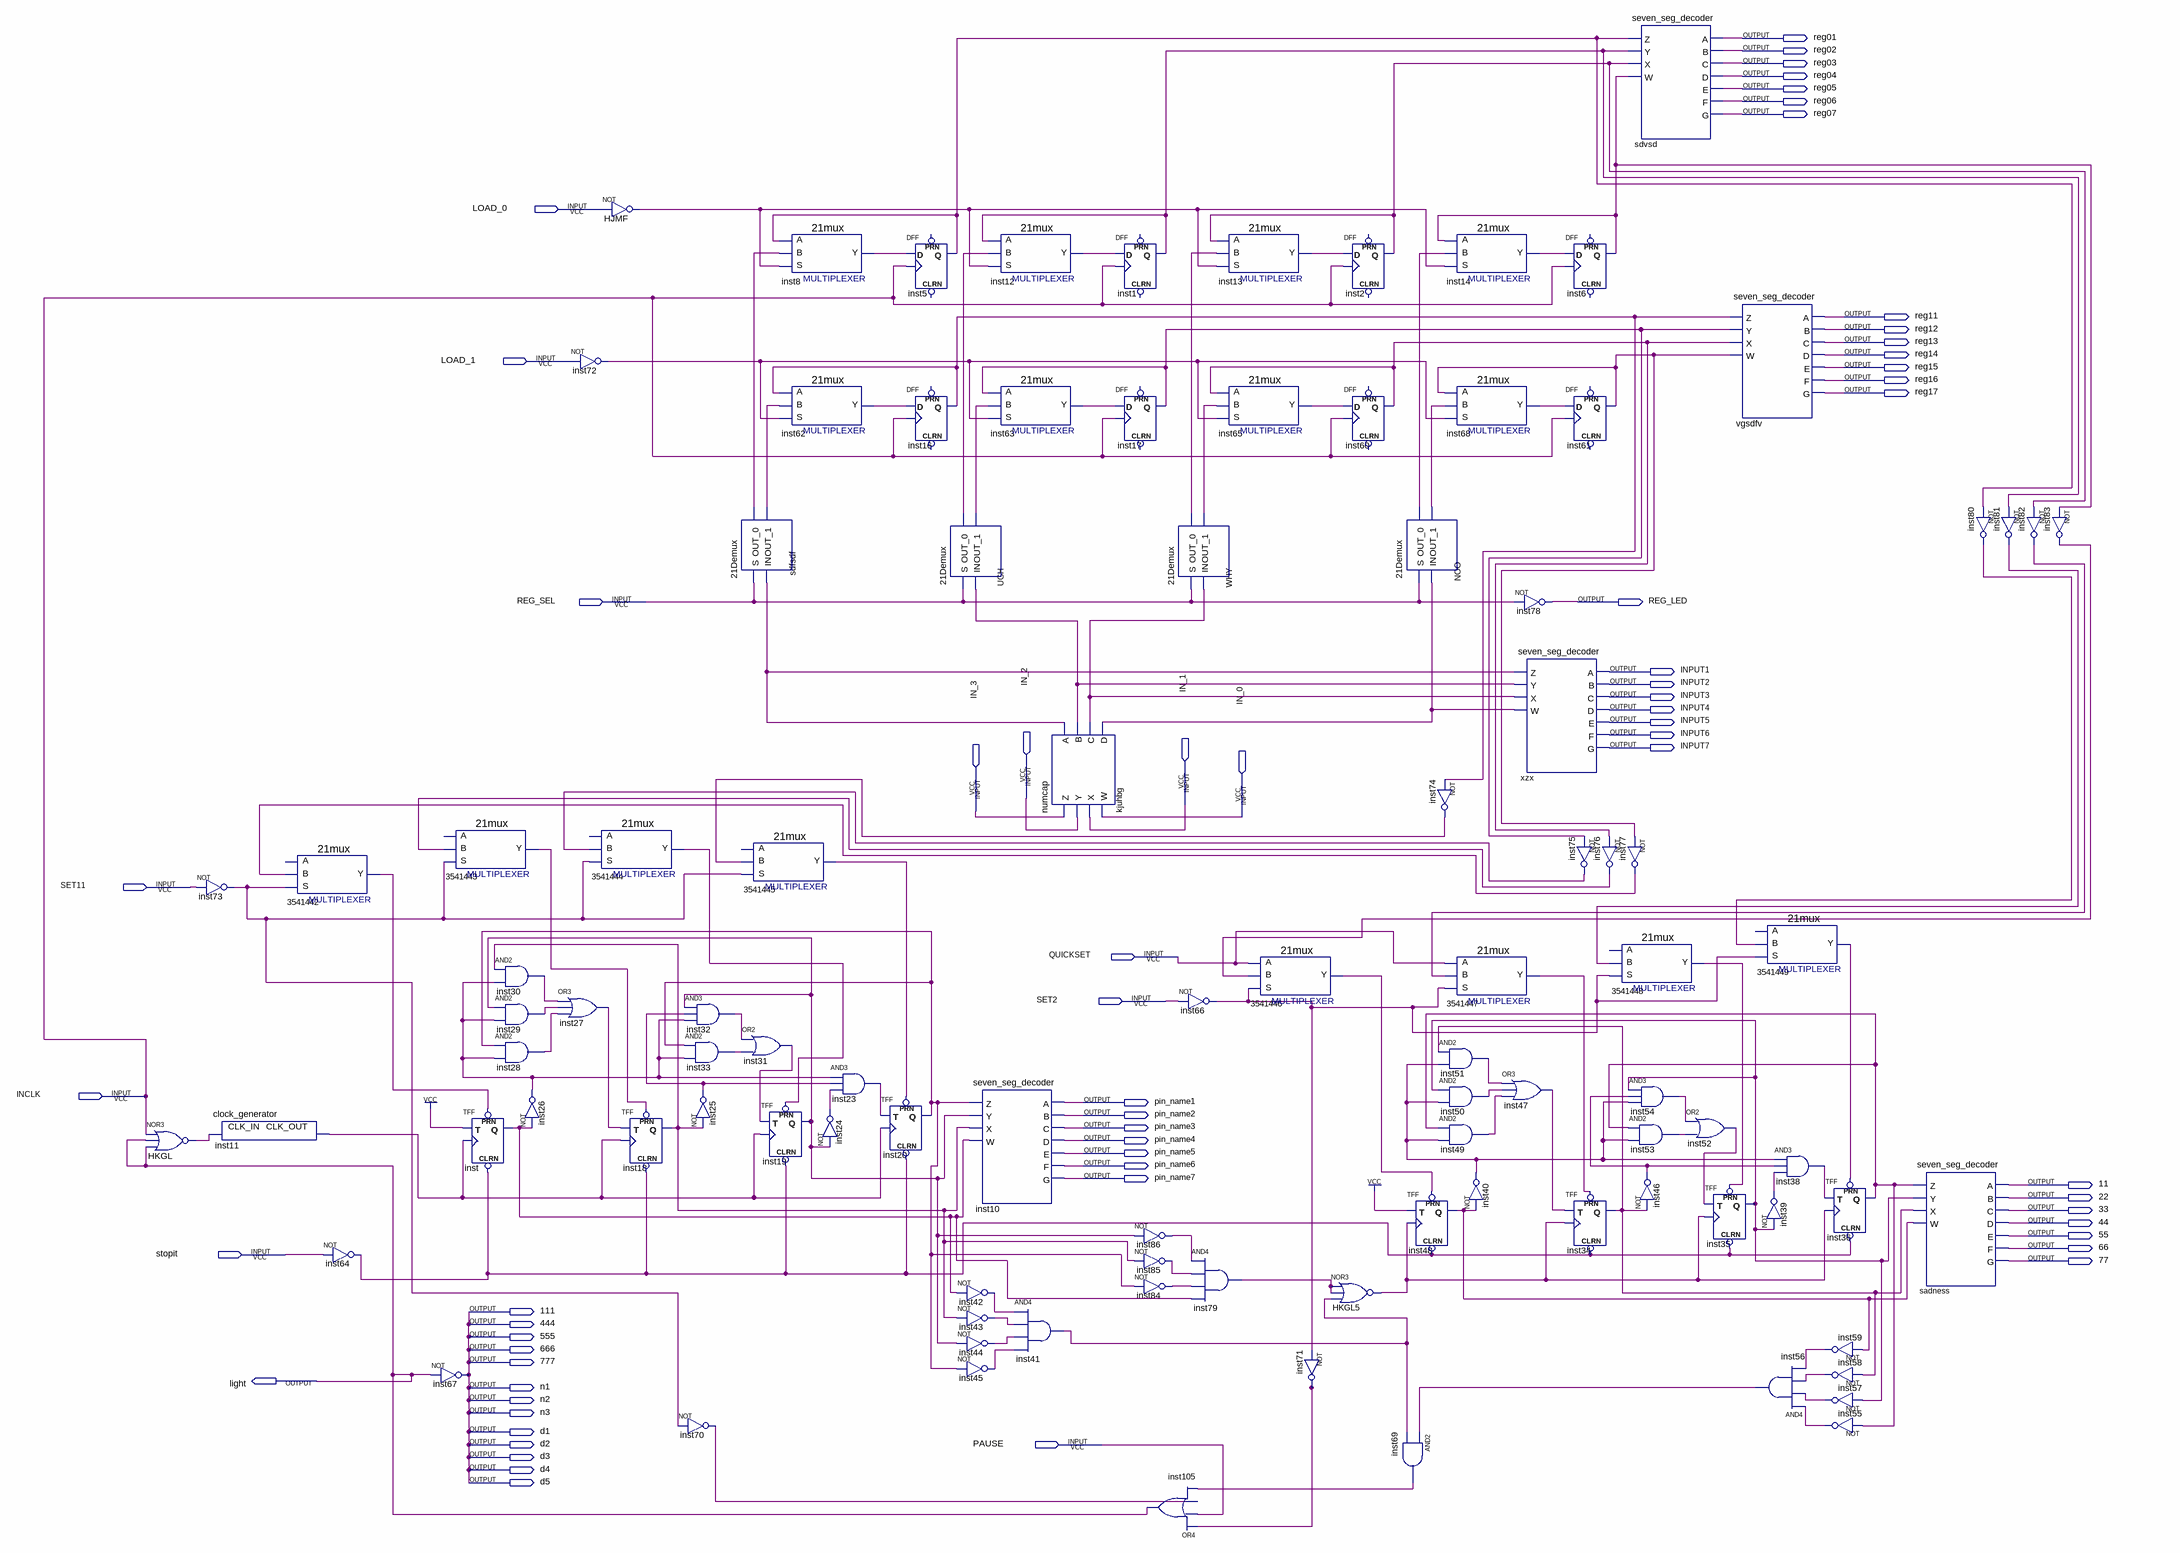
[diagram p0: schematic sheet]
// Quartus schematic proj.bdf as structural Verilog: 100 symbols, 63 pins
module proj (
  input  LOAD_0,
  input  LOAD_1,
  input  REG_SEL,
  input  IN_2,
  input  IN_1,
  input  IN_3,
  input  IN_0,
  input  SET11,
  input  QUICKSET,
  input  SET2,
  input  INCLK,
  input  stopit,
  input  PAUSE,
  output reg01,
  output reg02,
  output reg03,
  output reg04,
  output reg05,
  output reg06,
  output reg07,
  output reg11,
  output reg12,
  output reg13,
  output reg14,
  output reg15,
  output reg16,
  output reg17,
  output REG_LED,
  output INPUT1,
  output INPUT2,
  output INPUT3,
  output INPUT4,
  output INPUT5,
  output INPUT6,
  output INPUT7,
  output pin_name1,
  output pin_name2,
  output pin_name3,
  output pin_name4,
  output pin_name5,
  output pin_name6,
  output pin_name7,
  output \11 ,
  output \22 ,
  output \33 ,
  output \44 ,
  output \55 ,
  output \66 ,
  output \77 ,
  output \111 ,
  output \444 ,
  output \555 ,
  output \666 ,
  output \777 ,
  output light,
  output n1,
  output n2,
  output n3,
  output d1,
  output d2,
  output d3,
  output d4,
  output d5
);

  wire HJMF_out, HKGL5_out, HKGL_out, inst1_q, inst2_q, inst5_q, inst6_q, inst8_y, inst11_clk_out, inst12_y,
       inst13_y, inst14_y, inst16_q, inst17_q, inst18_q, inst19_q, inst20_q, inst23_out, inst24_out,
       inst25_out, inst26_out, inst27_out, inst28_out, inst29_out, inst30_out, inst31_out, inst32_out,
       inst33_out, inst34_q, inst35_q, inst36_q, inst38_out, inst39_out, inst40_out, inst41_out, inst42_out,
       inst43_out, inst44_out, inst45_out, inst46_out, inst47_out, inst48_q, inst49_out, inst50_out,
       inst51_out, inst52_out, inst53_out, inst54_out, inst55_out, inst56_out, inst57_out, inst58_out,
       inst59_out, inst60_q, inst61_q, inst62_y, inst63_y, inst64_out, inst65_y, inst66_out, inst68_y,
       inst69_out, inst70_out, inst71_out, inst72_out, inst73_out, inst74_out, inst75_out, inst76_out,
       inst77_out, inst79_out, inst80_out, inst81_out, inst82_out, inst83_out, inst84_out, inst85_out,
       inst86_out, inst_q, kjuhbg_a, kjuhbg_b, kjuhbg_c, kjuhbg_d, n3541442_y, n3541443_y, n3541444_y,
       n3541445_y, n3541446_y, n3541447_y, n3541448_y, n3541449_y, NOO_out_0, NOO_out_1, sdfsdf_out_0,
       sdfsdf_out_1, UGH_out_0, UGH_out_1, WHY_out_0, WHY_out_1;

  nor HKGL (HKGL_out, INCLK, light, light);
  not inst73 (inst73_out, SET11);
  clock_generator inst11 (.CLK_IN(HKGL_out), .CLK_OUT(inst11_clk_out));
  \21mux  u_3541442 (.S(inst73_out), .B(inst77_out), .Y(n3541442_y));  // open: A
  not inst64 (inst64_out, stopit);
  not inst67 (\111 , light);
  \21mux  u_3541443 (.S(inst73_out), .B(inst76_out), .Y(n3541443_y));  // open: A
  TFF inst (.PRN(n3541442_y), .CLRN(inst64_out), .T(1'b1), .CLK(inst11_clk_out), .Q(inst_q));
  and inst30 (inst30_out, inst18_q, inst26_out);
  and inst29 (inst29_out, inst19_q, inst26_out);
  and inst28 (inst28_out, inst20_q, inst26_out);
  not inst26 (inst26_out, inst_q);
  not inst72 (inst72_out, LOAD_1);
  or inst27 (inst27_out, inst30_out, inst29_out, inst28_out);
  not HJMF (HJMF_out, LOAD_0);
  \21mux  u_3541444 (.S(inst73_out), .B(inst75_out), .Y(n3541444_y));  // open: A
  TFF inst18 (.PRN(n3541443_y), .CLRN(inst64_out), .T(inst27_out), .CLK(inst11_clk_out), .Q(inst18_q));
  and inst32 (inst32_out, inst19_q, inst25_out, inst26_out);
  and inst33 (inst33_out, inst20_q, inst26_out);
  not inst70 (inst70_out, inst73_out);
  \21Demux  sdfsdf (.S(REG_SEL), .IN(kjuhbg_a), .OUT_0(sdfsdf_out_0), .OUT_1(sdfsdf_out_1));
  not inst25 (inst25_out, inst18_q);
  \21mux  inst8 (.S(HJMF_out), .B(sdfsdf_out_0), .A(inst5_q), .Y(inst8_y));
  \21mux  inst62 (.S(inst72_out), .B(sdfsdf_out_1), .A(inst16_q), .Y(inst62_y));
  \21mux  u_3541445 (.S(inst73_out), .B(inst74_out), .Y(n3541445_y));  // open: A
  or inst31 (inst31_out, inst32_out, inst33_out);
  TFF inst19 (.PRN(n3541444_y), .CLRN(inst64_out), .T(inst31_out), .CLK(inst11_clk_out), .Q(inst19_q));
  and inst23 (inst23_out, inst26_out, inst25_out, inst24_out);
  not inst24 (inst24_out, inst19_q);
  TFF inst20 (.PRN(n3541445_y), .CLRN(inst64_out), .T(inst23_out), .CLK(inst11_clk_out), .Q(inst20_q));
  DFF inst5 (.CLK(INCLK), .D(inst8_y), .Q(inst5_q));  // open: CLRN, PRN
  DFF inst16 (.CLK(INCLK), .D(inst62_y), .Q(inst16_q));  // open: CLRN, PRN
  \21Demux  UGH (.S(REG_SEL), .IN(kjuhbg_b), .OUT_0(UGH_out_0), .OUT_1(UGH_out_1));
  \21mux  inst12 (.S(HJMF_out), .B(UGH_out_0), .A(inst1_q), .Y(inst12_y));
  \21mux  inst63 (.S(inst72_out), .B(UGH_out_1), .A(inst17_q), .Y(inst63_y));
  seven_seg_decoder inst10 (
    .Z(inst20_q), .Y(inst19_q), .X(inst18_q), .W(inst_q), .A(pin_name1), .B(pin_name2), .C(pin_name3),
    .D(pin_name4), .E(pin_name5), .F(pin_name6), .G(pin_name7));
  not inst42 (inst42_out, inst_q);
  not inst43 (inst43_out, inst18_q);
  not inst44 (inst44_out, inst19_q);
  not inst45 (inst45_out, inst20_q);
  numcap kjuhbg (.Z(IN_3), .Y(IN_2), .X(IN_1), .W(IN_0), .A(kjuhbg_a), .B(kjuhbg_b), .C(kjuhbg_c), .D(kjuhbg_d));
  and inst41 (inst41_out, inst42_out, inst43_out, inst44_out, inst45_out);
  DFF inst1 (.CLK(INCLK), .D(inst12_y), .Q(inst1_q));  // open: CLRN, PRN
  DFF inst17 (.CLK(INCLK), .D(inst63_y), .Q(inst17_q));  // open: CLRN, PRN
  not inst86 (inst86_out, inst19_q);
  not inst85 (inst85_out, inst18_q);
  not inst84 (inst84_out, inst20_q);
  \21Demux  WHY (.S(REG_SEL), .IN(kjuhbg_c), .OUT_0(WHY_out_0), .OUT_1(WHY_out_1));
  not inst66 (inst66_out, SET2);
  and inst79 (inst79_out, inst86_out, inst85_out, inst84_out, inst_q);
  or inst105 (light, inst71_out, PAUSE, inst70_out, inst69_out);
  \21mux  inst13 (.S(HJMF_out), .B(WHY_out_0), .A(inst2_q), .Y(inst13_y));
  \21mux  inst65 (.S(inst72_out), .B(WHY_out_1), .A(inst60_q), .Y(inst65_y));
  \21mux  u_3541446 (.S(inst66_out), .B(inst83_out), .A(QUICKSET), .Y(n3541446_y));
  DFF inst2 (.CLK(INCLK), .D(inst13_y), .Q(inst2_q));  // open: CLRN, PRN
  DFF inst60 (.CLK(INCLK), .D(inst65_y), .Q(inst60_q));  // open: CLRN, PRN
  nor HKGL5 (HKGL5_out, inst79_out, inst79_out, inst41_out);
  not inst71 (inst71_out, inst66_out);
  \21Demux  NOO (.S(REG_SEL), .IN(kjuhbg_d), .OUT_0(NOO_out_0), .OUT_1(NOO_out_1));
  and inst69 (inst69_out, inst56_out, inst41_out);
  \21mux  inst14 (.S(HJMF_out), .B(NOO_out_0), .A(inst6_q), .Y(inst14_y));
  \21mux  inst68 (.S(inst72_out), .B(NOO_out_1), .A(inst61_q), .Y(inst68_y));
  not inst74 (inst74_out, inst16_q);
  \21mux  u_3541447 (.S(inst66_out), .B(inst82_out), .A(QUICKSET), .Y(n3541447_y));
  and inst51 (inst51_out, inst34_q, inst40_out);
  and inst50 (inst50_out, inst35_q, inst40_out);
  and inst49 (inst49_out, inst36_q, inst40_out);
  TFF inst48 (.PRN(n3541446_y), .CLRN(inst64_out), .T(1'b1), .CLK(HKGL5_out), .Q(inst48_q));
  not inst40 (inst40_out, inst48_q);
  not inst78 (REG_LED, REG_SEL);
  seven_seg_decoder xzx (
    .Z(kjuhbg_a), .Y(kjuhbg_b), .X(kjuhbg_c), .W(kjuhbg_d), .A(INPUT1), .B(INPUT2), .C(INPUT3), .D(INPUT4),
    .E(INPUT5), .F(INPUT6), .G(INPUT7));
  or inst47 (inst47_out, inst51_out, inst50_out, inst49_out);
  DFF inst6 (.CLK(INCLK), .D(inst14_y), .Q(inst6_q));  // open: CLRN, PRN
  DFF inst61 (.CLK(INCLK), .D(inst68_y), .Q(inst61_q));  // open: CLRN, PRN
  not inst75 (inst75_out, inst17_q);
  not inst76 (inst76_out, inst60_q);
  TFF inst34 (.PRN(n3541447_y), .CLRN(inst64_out), .T(inst47_out), .CLK(HKGL5_out), .Q(inst34_q));
  seven_seg_decoder sdvsd (
    .Z(inst5_q), .Y(inst1_q), .X(inst2_q), .W(inst6_q), .A(reg01), .B(reg02), .C(reg03), .D(reg04),
    .E(reg05), .F(reg06), .G(reg07));
  not inst77 (inst77_out, inst61_q);
  \21mux  u_3541448 (.S(inst66_out), .B(inst81_out), .Y(n3541448_y));  // open: A
  and inst54 (inst54_out, inst35_q, inst46_out, inst40_out);
  and inst53 (inst53_out, inst36_q, inst40_out);
  not inst46 (inst46_out, inst34_q);
  or inst52 (inst52_out, inst54_out, inst53_out);
  seven_seg_decoder vgsdfv (
    .Z(inst16_q), .Y(inst17_q), .X(inst60_q), .W(inst61_q), .A(reg11), .B(reg12), .C(reg13), .D(reg14),
    .E(reg15), .F(reg16), .G(reg17));
  TFF inst35 (.PRN(n3541448_y), .CLRN(inst64_out), .T(inst52_out), .CLK(HKGL5_out), .Q(inst35_q));
  \21mux  u_3541449 (.S(inst66_out), .B(inst80_out), .Y(n3541449_y));  // open: A
  and inst38 (inst38_out, inst40_out, inst46_out, inst39_out);
  not inst39 (inst39_out, inst35_q);
  and inst56 (inst56_out, inst55_out, inst57_out, inst58_out, inst59_out);
  TFF inst36 (.PRN(n3541449_y), .CLRN(inst64_out), .T(inst38_out), .CLK(HKGL5_out), .Q(inst36_q));
  not inst59 (inst59_out, inst48_q);
  not inst58 (inst58_out, inst34_q);
  not inst57 (inst57_out, inst35_q);
  not inst55 (inst55_out, inst36_q);
  seven_seg_decoder sadness (
    .Z(inst36_q), .Y(inst35_q), .X(inst34_q), .W(inst48_q), .A(\11 ), .B(\22 ), .C(\33 ), .D(\44 ), .E(\55 ),
    .F(\66 ), .G(\77 ));
  not inst80 (inst80_out, inst5_q);
  not inst81 (inst81_out, inst1_q);
  not inst82 (inst82_out, inst2_q);
  not inst83 (inst83_out, inst6_q);

  assign \444  = \111 ;
  assign \555  = \111 ;
  assign \666  = \111 ;
  assign \777  = \111 ;
  assign d1 = \111 ;
  assign d2 = \111 ;
  assign d3 = \111 ;
  assign d4 = \111 ;
  assign d5 = \111 ;
  assign n1 = \111 ;
  assign n2 = \111 ;
  assign n3 = \111 ;
endmodule
